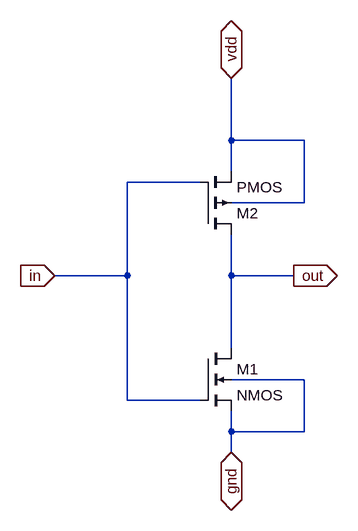
[diagram p0: schematic inv1x.asc]
inv1x.asc, the LTspice schematic file:
Version 4
SHEET 1 880 680
WIRE 224 -128 224 -224
WIRE 336 -128 224 -128
WIRE 224 -80 224 -128
WIRE 176 -64 64 -64
WIRE 336 -32 336 -128
WIRE 336 -32 224 -32
WIRE 64 80 64 -64
WIRE 64 80 -48 80
WIRE 224 80 224 16
WIRE 320 80 224 80
WIRE 224 192 224 80
WIRE 336 240 224 240
WIRE 64 272 64 80
WIRE 176 272 64 272
WIRE 224 320 224 288
WIRE 336 320 336 240
WIRE 336 320 224 320
WIRE 224 352 224 320
FLAG 224 -224 vdd
IOPIN 224 -224 BiDir
FLAG 224 352 gnd
IOPIN 224 352 BiDir
FLAG 320 80 out
IOPIN 320 80 Out
FLAG -48 80 in
IOPIN -48 80 In
SYMBOL nmos4 176 192 R0
SYMATTR InstName M1
SYMATTR Value2 l=180n w=360n m=1
SYMBOL pmos4 176 16 M180
SYMATTR InstName M2
SYMATTR Value2 l=180n w=720n m=1

The netlist it stands for:
* inv1x.asc
M1 out in gnd gnd NMOS l=180n w=360n m=1
M2 out in vdd vdd PMOS l=180n w=720n m=1
.model NMOS NMOS
.model PMOS PMOS
.lib standard.mos
.backanno
.end